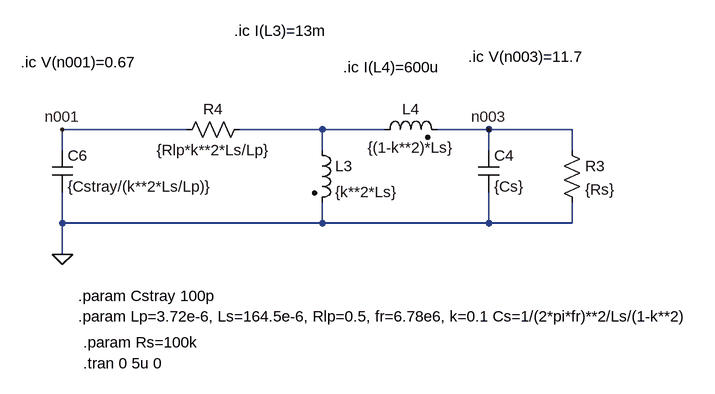
[diagram p0: schematic tesla_HFSSTC_ZVS_condition_v2.asc]
tesla_HFSSTC_ZVS_condition_v2.asc, the LTspice schematic file:
Version 4
SHEET 1 880 680
WIRE -80 80 -272 80
WIRE 128 80 0 80
WIRE 224 80 128 80
WIRE 384 80 304 80
WIRE 512 80 384 80
WIRE -272 112 -272 80
WIRE 128 112 128 80
WIRE 384 112 384 80
WIRE 512 112 512 80
WIRE -272 224 -272 176
WIRE 128 224 128 192
WIRE 128 224 -272 224
WIRE 384 224 384 176
WIRE 384 224 128 224
WIRE 512 224 512 192
WIRE 512 224 384 224
WIRE -272 272 -272 224
FLAG -272 80 n001
FLAG 384 80 n003
FLAG -272 272 0
SYMBOL res 496 96 R0
SYMATTR InstName R3
SYMATTR Value {Rs}
SYMBOL res -96 96 R270
WINDOW 0 32 56 VTop 2
WINDOW 3 0 56 VBottom 2
SYMATTR InstName R4
SYMATTR Value {Rlp*k**2*Ls/Lp}
SYMBOL ind2 112 96 R0
SYMATTR InstName L3
SYMATTR Value {k**2*Ls}
SYMATTR Type ind
SYMBOL cap 368 112 R0
SYMATTR InstName C4
SYMATTR Value {Cs}
SYMBOL cap -288 176 M180
WINDOW 0 24 56 Left 2
WINDOW 3 24 8 Left 2
SYMATTR InstName C6
SYMATTR Value {Cstray/(k**2*Ls/Lp)}
SYMBOL ind2 208 96 R270
WINDOW 0 32 56 VTop 2
WINDOW 3 4 56 VBottom 2
SYMATTR InstName L4
SYMATTR Value {(1-k**2)*Ls}
SYMATTR Type ind
TEXT -248 368 Left 2 !.param Lp=3.72e-6, Ls=164.5e-6, Rlp=0.5, fr=6.78e6, k=0.1 Cs=1/(2*pi*fr)**2/Ls/(1-k**2)
TEXT -248 336 Left 2 !.param Cstray 100p
TEXT -336 -24 Left 2 !.ic V(n001)=0.67
TEXT 352 -32 Left 2 !.ic V(n003)=11.7
TEXT -8 -72 Left 2 !.ic I(L3)=13m
TEXT 160 -16 Left 2 !.ic I(L4)=600u
TEXT -240 440 Left 2 !.tran 0 5u 0
TEXT -240 408 Left 2 !.param Rs=100k

The netlist it stands for:
* tesla_HFSSTC_ZVS_condition_v2.asc
R3 n003 0 {Rs}
R4 n001 N002 {Rlp*k**2*Ls/Lp}
L3 N002 0 {k**2*Ls}
C4 n003 0 {Cs}
C6 0 n001 {Cstray/(k**2*Ls/Lp)}
L4 N002 n003 {(1-k**2)*Ls}
.param Lp=3.72e-6, Ls=164.5e-6, Rlp=0.5, fr=6.78e6, k=0.1 Cs=1/(2*pi*fr)**2/Ls/(1-k**2)
.param Cstray 100p
.ic V(n001)=0.67
.ic V(n003)=11.7
.ic I(L3)=13m
.ic I(L4)=600u
.tran 0 5u 0
.param Rs=100k
.backanno
.end